# EAGLE design board (EAGLE 6.4)
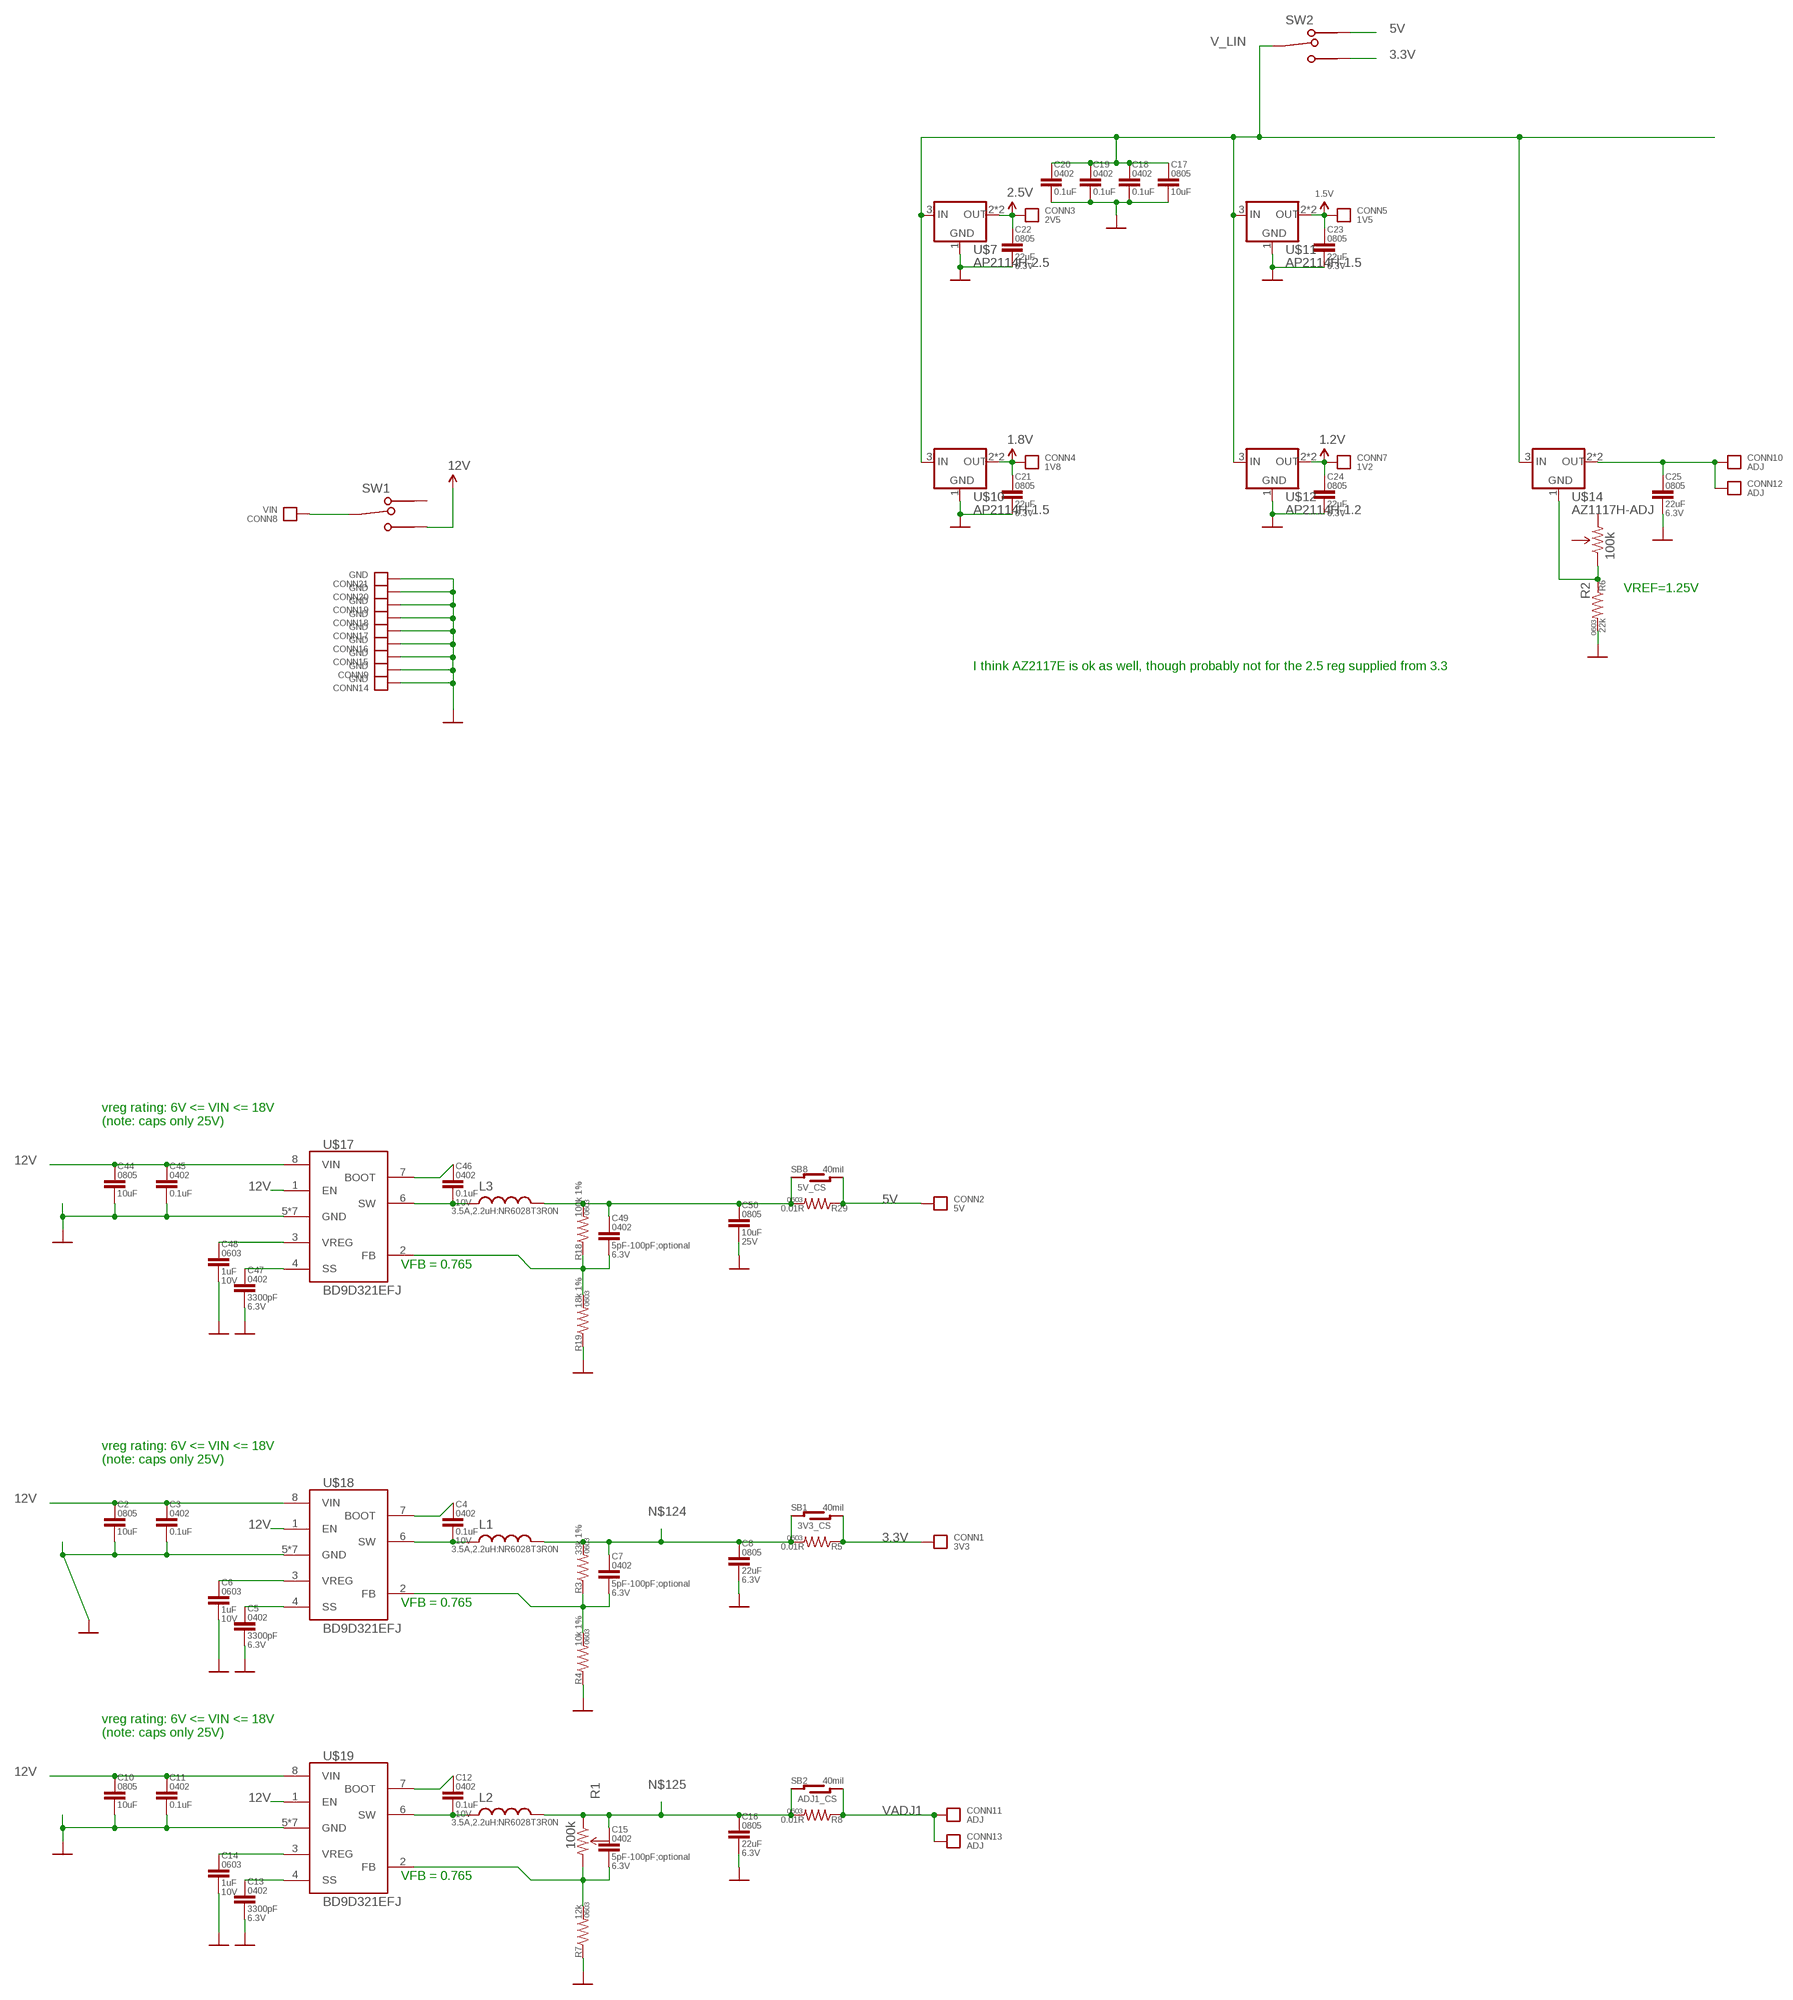
[diagram p0: schematic, sheet 1]

## Parts
C2  10uF  CAP0805  [0805-CAP]
C3  0.1uF  CAP0402-CAP  [0402-CAP]
C4  0.1uF  CAP0402-CAP  [0402-CAP]
C5  3300pF  CAP0402-CAP  [0402-CAP]
C6  1uF  CAP0603  [0603-CAP]
C7  5pF-100pF;optional  CAP0402-CAP  [0402-CAP]
C8  22uF  CAP0805  [0805-CAP]
C10  10uF  CAP0805  [0805-CAP]
C11  0.1uF  CAP0402-CAP  [0402-CAP]
C12  0.1uF  CAP0402-CAP  [0402-CAP]
C13  3300pF  CAP0402-CAP  [0402-CAP]
C14  1uF  CAP0603  [0603-CAP]
C15  5pF-100pF;optional  CAP0402-CAP  [0402-CAP]
C16  22uF  CAP0805  [0805-CAP]
C17  10uF  CAP0805  [0805-CAP]
C18  0.1uF  CAP0402-CAP  [0402-CAP]
C19  0.1uF  CAP0402-CAP  [0402-CAP]
C20  0.1uF  CAP0402-CAP  [0402-CAP]
C21  22uF  CAP0805  [0805-CAP]
C22  22uF  CAP0805  [0805-CAP]
C23  22uF  CAP0805  [0805-CAP]
C24  22uF  CAP0805  [0805-CAP]
C25  22uF  CAP0805  [0805-CAP]
C44  10uF  CAP0805  [0805-CAP]
C45  0.1uF  CAP0402-CAP  [0402-CAP]
C46  0.1uF  CAP0402-CAP  [0402-CAP]
C47  3300pF  CAP0402-CAP  [0402-CAP]
C48  1uF  CAP0603  [0603-CAP]
C49  5pF-100pF;optional  CAP0402-CAP  [0402-CAP]
C50  10uF  CAP0805  [0805-CAP]
CONN1  3V3  CONNECTOR22AWG  [HOLE_22AWG]
CONN2  5V  CONNECTOR22AWG  [HOLE_22AWG]
CONN3  2V5  CONNECTOR22AWG  [HOLE_22AWG]
CONN4  1V8  CONNECTOR22AWG  [HOLE_22AWG]
CONN5  1V5  CONNECTOR22AWG  [HOLE_22AWG]
CONN7  1V2  CONNECTOR22AWG  [HOLE_22AWG]
CONN8  VIN  CONNECTOR22AWG  [HOLE_22AWG]
CONN9  GND  CONNECTOR22AWG  [HOLE_22AWG]
CONN10  ADJ  CONNECTOR22AWG  [HOLE_22AWG]
CONN11  ADJ  CONNECTOR22AWG  [HOLE_22AWG]
CONN12  ADJ  CONNECTOR28AWG  [HOLE_28AWG]
CONN13  ADJ  CONNECTOR28AWG  [HOLE_28AWG]
CONN14  GND  CONNECTOR22AWG  [HOLE_22AWG]
CONN15  GND  CONNECTOR22AWG  [HOLE_22AWG]
CONN16  GND  CONNECTOR22AWG  [HOLE_22AWG]
CONN17  GND  CONNECTOR22AWG  [HOLE_22AWG]
CONN18  GND  CONNECTOR22AWG  [HOLE_22AWG]
CONN19  GND  CONNECTOR22AWG  [HOLE_22AWG]
CONN20  GND  CONNECTOR22AWG  [HOLE_22AWG]
CONN21  GND  CONNECTOR22AWG  [HOLE_22AWG]
L1  3.5A,2.2uH:NR6028T3R0N  INDUCTORNR60XX  [NR60XX]
L2  3.5A,2.2uH:NR6028T3R0N  INDUCTORNR60XX  [NR60XX]
L3  3.5A,2.2uH:NR6028T3R0N  INDUCTORNR60XX  [NR60XX]
R1  100k  TRIMPOTPTH  [TRIM_POT_PTH]
R2  100k  TRIMPOTPTH  [TRIM_POT_PTH]
R3  33k 1%  RESISTOR0603  [0603-RES]
R4  10k 1%  RESISTOR0603  [0603-RES]
R5  0.01R  RESISTOR0603  [0603-RES]
R6  22k  RESISTOR0603  [0603-RES]
R7  12k  RESISTOR0603  [0603-RES]
R8  0.01R  RESISTOR0603  [0603-RES]
R18  100k 1%  RESISTOR0603  [0603-RES]
R19  18k 1%  RESISTOR0603  [0603-RES]
R29  0.01R  RESISTOR0603  [0603-RES]
SB1  3V3_CS  SOLDER-BRIDGEOPEN-WIDE  [SOLDER-BRIDGE-OPEN-LARGE]
SB2  ADJ1_CS  SOLDER-BRIDGEOPEN-WIDE  [SOLDER-BRIDGE-OPEN-LARGE]
SB8  5V_CS  SOLDER-BRIDGEOPEN-WIDE  [SOLDER-BRIDGE-OPEN-LARGE]
SW1  SWITCH_SPDT  [SWITCH_SLIDE_SPDT]
SW2  SWITCH_SPDT  [SWITCH_SLIDE_SPDT]
U$7  AP2114H-2.5  VREGSOT223  [SOT223]
U$10  AP2114H-1.5  VREGSOT223  [SOT223]
U$11  AP2114H-1.5  VREGSOT223  [SOT223]
U$12  AP2114H-1.2  VREGSOT223  [SOT223]
U$14  AZ1117H-ADJ  VREGSOT223  [SOT223]
U$17  BD9D321EFJ  [HTSOP8]
U$18  BD9D321EFJ  [HTSOP8]
U$19  BD9D321EFJ  [HTSOP8]

## Nets
1.2V: C24.1 CONN7.P U$12.2(OUT) U$12.4(OUT)
1.5V: C23.1 CONN5.P U$11.2(OUT) U$11.4(OUT)
1.8V: C21.1 CONN4.P U$10.2(OUT) U$10.4(OUT)
2.5V: C22.1 CONN3.P U$7.2(OUT) U$7.4(OUT)
3.3V: CONN1.P R5.1 SB1.R1 SB1.R2 SW2.P2
3.3V_FB: C49.2 R18.1 R19.2 U$17.2(FB)
3.3V_FB1: C7.2 R3.1 R4.2 U$18.2(FB)
3.3V_FB2: C15.2 R1.3(CW) R7.2 U$19.2(FB)
5V: CONN2.P R29.1 SB8.R1 SB8.R2 SW2.P1
12V: C2.1 C3.1 C10.1 C11.1 C44.1 C45.1 SW1.P2 U$17.1(EN) U$17.8(VIN) U$18.1(EN) U$18.8(VIN) U$19.1(EN) U$19.8(VIN)
GND: C2.2 C3.2 C5.2 C6.2 C8.2 C10.2 C11.2 C13.2 C14.2 C16.2 C17.2 C18.2 C19.2 C20.2 C21.2 C22.2 C23.2 C24.2 C25.2 C44.2 C45.2 C47.2 C48.2 C50.2 CONN9.P CONN14.P CONN15.P CONN16.P CONN17.P CONN18.P CONN19.P CONN20.P CONN21.P R4.1 R6.2 R7.1 R19.1 U$7.1(GND) U$10.1(GND) U$11.1(GND) U$12.1(GND) U$17.5(GND) U$17.P$1(GND) U$17.P$2(GND) U$17.P$3(GND) U$17.P$4(GND) U$17.P$5(GND) U$17.PAD(GND) U$18.5(GND) U$18.P$1(GND) U$18.P$2(GND) U$18.P$3(GND) U$18.P$4(GND) U$18.P$5(GND) U$18.PAD(GND) U$19.5(GND) U$19.P$1(GND) U$19.P$2(GND) U$19.P$3(GND) U$19.P$4(GND) U$19.P$5(GND) U$19.PAD(GND)
N$2: C25.1 CONN10.P CONN12.P U$14.2(OUT) U$14.4(OUT)
N$4: C4.1 U$18.7(BOOT)
N$5: C4.2 L1.P$1 U$18.6(SW)
N$6: C6.1 U$18.3(VREG)
N$7: C5.1 U$18.4(SS)
N$8: C12.1 U$19.7(BOOT)
N$9: C12.2 L2.P$1 U$19.6(SW)
N$10: C14.1 U$19.3(VREG)
N$11: C13.1 U$19.4(SS)
N$12: R2.1(CCW) R6.1 U$14.1(GND)
N$70: C46.2 L3.P$1 U$17.6(SW)
N$71: C46.1 U$17.7(BOOT)
N$72: C48.1 U$17.3(VREG)
N$76: C47.1 U$17.4(SS)
N$123: C49.1 C50.1 L3.P$2 R18.2 R29.2 SB8.L1 SB8.L2
N$124: C7.1 C8.1 L1.P$2 R3.2 R5.2 SB1.L1 SB1.L2
N$125: C15.1 C16.1 L2.P$2 R1.1(CCW) R8.2 SB2.L1 SB2.L2
V_LIN: C17.1 C18.1 C19.1 C20.1 SW2.C U$7.3(IN) U$10.3(IN) U$11.3(IN) U$12.3(IN) U$14.3(IN)
VADJ1: CONN11.P CONN13.P R8.1 SB2.R1 SB2.R2
VIN_UNSW: CONN8.P SW1.C
Unconnected: R1.2(WIPER) R2.2(WIPER) R2.3(CW) SW1.P1

## Notes on the sheet
- VREF=1.25V
- I think AZ2117E is ok as well, though probably not for the 2.5 reg supplied from 3.3
- vreg rating: 6V <= VIN <= 18V
  (note: caps only 25V)
- VFB = 0.765
- vreg rating: 6V <= VIN <= 18V
  (note: caps only 25V)
- VFB = 0.765
- vreg rating: 6V <= VIN <= 18V
  (note: caps only 25V)
- VFB = 0.765

## Library data of the parts
C2 C10 C17 C44 C50 = kmod-passives:CAP: Capacitor Standard 0603 ceramic capacitor, and 0.1" leaded capacitor.; PACKAGE: 0805; VOLTAGE: 25V
C3 C11 C18-C20 C45 = kmod-passives:CAP: Capacitor Standard 0603 ceramic capacitor, and 0.1" leaded capacitor.; PACKAGE: 0402; VOLTAGE: 25V
C4 C12 C46 = kmod-passives:CAP: Capacitor Standard 0603 ceramic capacitor, and 0.1" leaded capacitor.; PACKAGE: 0402; VOLTAGE: 10V
C5 C7 C13 C15 C47 C49 = kmod-passives:CAP: Capacitor Standard 0603 ceramic capacitor, and 0.1" leaded capacitor.; PACKAGE: 0402; VOLTAGE: 6.3V
C6 C14 C48 = kmod-passives:CAP: Capacitor Standard 0603 ceramic capacitor, and 0.1" leaded capacitor.; PACKAGE: 0603; VOLTAGE: 10V
C8 C16 C21-C25 = kmod-passives:CAP: Capacitor Standard 0603 ceramic capacitor, and 0.1" leaded capacitor.; PACKAGE: 0805; VOLTAGE: 6.3V
CONN1-CONN5 CONN7-CONN21 = kmod-nonparts:CONNECTOR: Collection of holes/pads for testing/connecting
L1-L3 = kmod-passives:INDUCTOR
R1 R2 = SparkFun-Electromechanical:TRIMPOT: Various small potentiometers for "set-and-forget" applications
R3-R8 R18 R19 R29 = kmod-passives:RESISTOR: Resistor Basic schematic elements and footprints for 0603, 1206, and PTH resistors.; PACKAGE: 0603
SB1 SB2 SB8 = kmod-nonparts:SOLDER-BRIDGE; PACKAGE: 40mil
SW1 SW2 = kmod-mechanical:SWITCH_SPDT
U$7 U$10-U$12 U$14 = kmod-ics:VREG
U$17-U$19 = kmod-testing:BD9D321

## Board
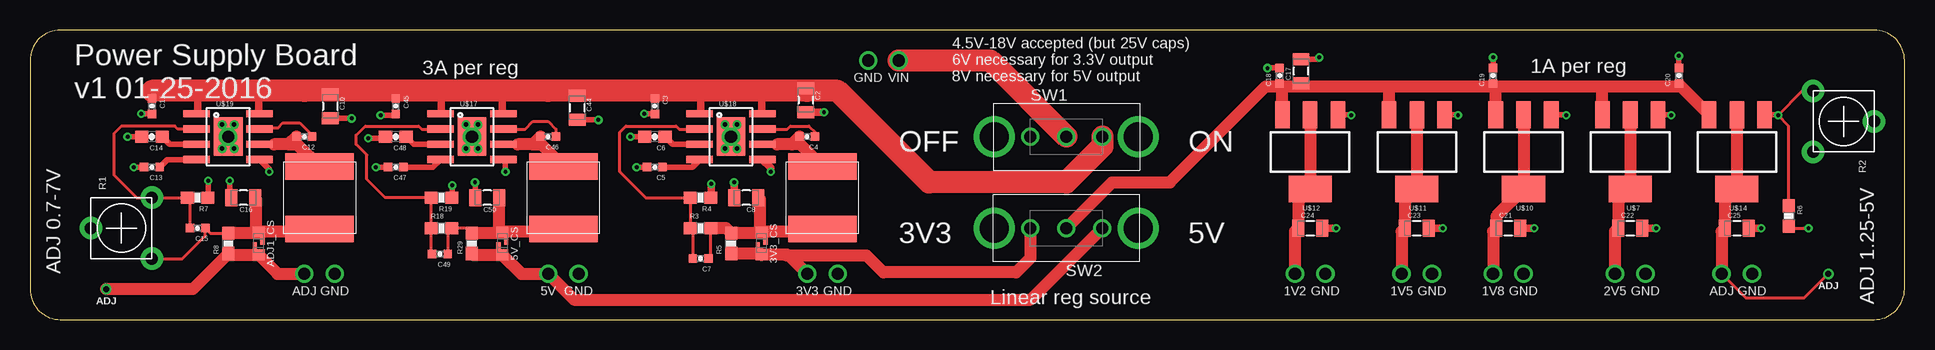
[diagram p1: board, top side]
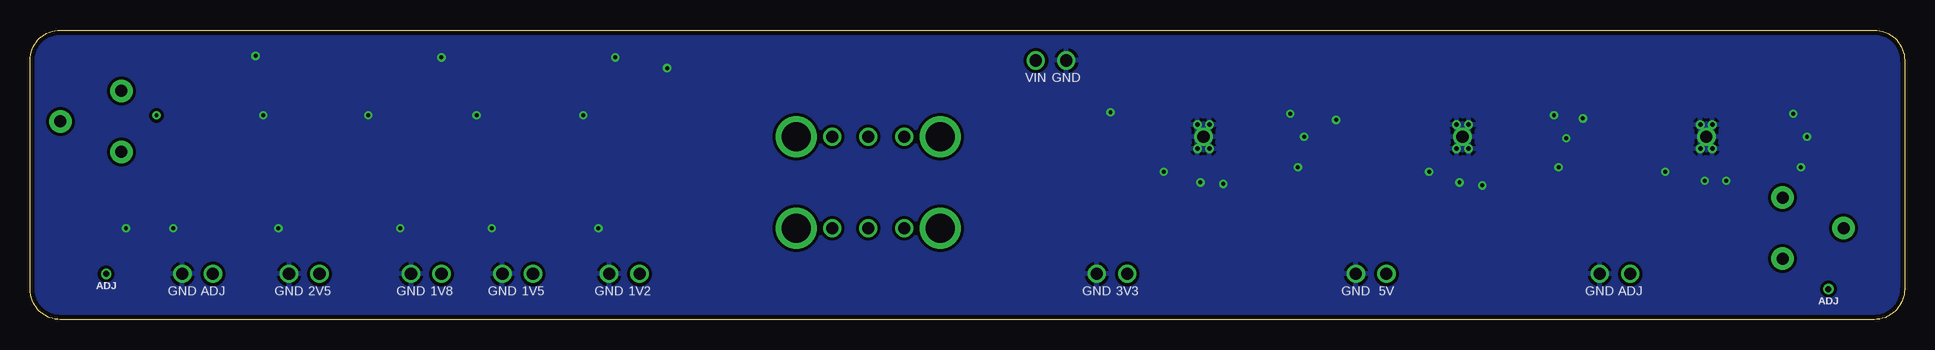
[diagram p2: board, bottom side, seen from below]

Size 156.21 x 24.13 mm. Coordinates in mm from the lower left corner, seen from the top.
Outline: 0,21.59 0,2.54 arc90 2.54,0 153.67,0 arc90 156.21,2.54 156.21,21.59 arc90 153.67,24.13 2.54,24.13 arc90 0,21.59
Copper layers (1*16): Top 0.0356mm / dielectric 1.5011mm / Bottom 0.0356mm
Design rules "OSHPark_mine": minimum track width 6mil, minimum drill 13mil, track to track 6mil, track to pad 6mil, pad to pad 6mil, via to via 6mil, smd to smd 6mil, copper to edge 15mil, drill to drill 6mil, minimum pad ring 7mil, minimum via ring 7mil, stop-mask expansion 2mil, vias tented up to drill 13mil, thermal gap 10mil

### Footprints (pad centres in the part's own frame; a part is rotated, then mirrored left to right if it is on the bottom)
0805-CAP = smd 1 x 1.4: 1 -1,0; 2 1,0
0402-CAP = smd 0.7 x 0.7: 1 -0.65,0; 2 0.65,0
0603-CAP = smd 1.1 x 1: 1 -0.85,0; 2 0.85,0
HOLE_22AWG = drill 1.016: P 0,0
HOLE_28AWG = drill 0.508: P 0,0
NR60XX = smd 2.2 x 5.7: P$1 2.6,0; P$2 -2.6,0
TRIM_POT_PTH = drill 1 pad 1.88: 1 -2.54,-2.54; 2 0,2.54; 3 2.54,-2.54
0603-RES = smd 1.1 x 1: 1 -0.85,0; 2 0.85,0
SOLDER-BRIDGE-OPEN-LARGE = smd 0.9 x 1: L1 -0.95,0; R1 0.95,0 | smd 0.6 x 0.35: L2 -0.2,0.325; R2 0.2,-0.325
SWITCH_SLIDE_SPDT = drill 1: C 0,0; P1 -3,0; P2 3,0 | drill 2.4: MNT1 -6,0; MNT2 6,0
SOT223 = smd 1.219 x 2.235: 1 -2.311,-3.099; 2 0,-3.099; 3 2.311,-3.099 | smd 3.6 x 2.2: 4 0,3.099
HTSOP8 = smd 0.61 x 2.21: 1 -1.905,-2.616; 2 -0.635,-2.616; 3 0.635,-2.616; 4 1.905,-2.616; 5 1.905,2.616; 6 0.635,2.616; 7 -0.635,2.616; 8 -1.905,2.616 | drill 1.016: P$1 0,0 | drill 0.381: P$2 -1,0.5; P$3 -1,-0.5; P$4 1,-0.5; P$5 1,0.5 | smd 3.2 x 2.4: PAD 0,0

### Placement (x,y rotation side)
C2  64.64,18.29 270 top
C3  52.07,17.78 270 top
C4  64.77,15.24 180 top
C5  52.07,12.7 180 top
C6  52.07,15.24 180 top
C7  55.88,5.08 180 top
C8  59.69,10.16 180 top
C10  25.02,17.78 270 top
C11  10.16,17.78 270 top
C12  22.86,15.24 180 top
C13  10.16,12.7 180 top
C14  10.16,15.24 180 top
C15  13.97,7.62 180 top
C16  17.78,10.16 180 top
C17  105.92,20.7 90 top
C18  104.14,20.32 90 top
C19  121.92,20.32 90 top
C20  137.41,20.32 90 top
C21  123.19,7.62 0 top
C22  133.35,7.62 0 top
C23  115.57,7.62 0 top
C24  106.68,7.62 0 top
C25  142.24,7.62 0 top
C44  45.59,17.65 270 top
C45  30.48,17.78 270 top
C46  43.18,15.24 180 top
C47  30.48,12.7 180 top
C48  30.48,15.24 180 top
C49  34.16,5.46 180 top
C50  38.1,10.16 180 top
CONN1  64.77,3.81 0 top
CONN2  43.18,3.81 0 top
CONN3  132.08,3.81 0 top
CONN4  121.92,3.81 0 top
CONN5  114.3,3.81 0 top
CONN7  105.41,3.81 0 top
CONN8  72.39,21.59 0 top
CONN9  69.85,21.59 0 top
CONN10  140.97,3.81 0 top
CONN11  22.86,3.81 0 top
CONN12  149.86,3.81 0 top
CONN13  6.35,2.54 0 top
CONN14  45.72,3.81 0 top
CONN15  67.31,3.81 0 top
CONN16  25.4,3.81 0 top
CONN17  107.95,3.81 0 top
CONN18  116.84,3.81 0 top
CONN19  124.46,3.81 0 top
CONN20  134.62,3.81 0 top
CONN21  143.51,3.81 0 top
L1  66.04,10.16 90 top
L2  24.13,10.16 90 top
L3  44.45,10.16 90 top
R1  7.62,7.62 90 top
R2  151.13,16.51 270 top
R3  55.88,7.62 0 top
R4  55.88,10.16 180 top
R5  58.42,6.35 90 top
R6  146.56,8.64 270 top
R7  13.97,10.16 180 top
R8  16.51,6.35 90 top
R18  34.29,7.62 0 top
R19  34.29,10.16 180 top
R29  36.83,6.35 90 top
SB1  60.96,6.35 270 top
SB2  19.05,6.35 270 top
SB8  39.37,6.35 270 top
SW1  86.36,15.24 0 top
SW2  86.36,7.62 180 top
U$7  133.35,13.97 180 top
U$10  124.46,13.97 180 top
U$11  115.57,13.97 180 top
U$12  106.68,13.97 180 top
U$14  142.24,13.97 180 top
U$17  36.83,15.24 270 top
U$18  58.42,15.24 270 top
U$19  16.51,15.24 270 top

### Tracks (layer width: path | path; a pad name or v marks a point on that pad's centre or on a via)
1.2V
  Top 1.016: U$12.2 U$12.4 105.68,9.87 C24.1 105.41,7.35 CONN7.P
1.5V
  Top 1.016: U$11.2 U$11.4 114.57,9.87 C23.1 114.3,7.35 CONN5.P
1.8V
  Top 1.016: U$10.2 U$10.4 122.19,8.6 C21.1 121.92,7.35 CONN4.P
2.5V
  Top 1.016: U$7.2 U$7.4 132.35,9.87 C22.1 132.08,7.35 CONN3.P
3.3V
  Top 0.254: 60.86,5.5 60.63,5.72 SB1.R2
  Top 1.016: CONN1.P 63.18,5.4 62.99,5.4 | 62.99,5.4 SB1.R1 60.86,5.5 R5.1 | SW2.P2 83.36,5.13 82.17,3.94 71.12,3.94 69.72,5.33 63.06,5.33 62.99,5.4
3.3V_FB
  Top 0.254: U$17.2 32.64,15.88 32.38,16.13 27.94,16.13 27.18,15.37 27.18,14.61 28.07,13.72 28.07,11.68 29.59,10.16 R19.2 R18.1 33.44,5.53 C49.2
3.3V_FB1
  Top 0.254: U$18.2 54.1,15.88 53.85,16.13 49.66,16.13 49.15,15.62 49.15,12.32 51.31,10.16 R4.2 R3.1 55.23,7.42 C7.2
3.3V_FB2
  Top 0.254: U$19.2 12.32,15.88 12.06,16.13 7.62,16.13 6.99,15.49 6.99,12.06 8.89,10.16 R1.3 R7.2 13.32,9.96 C15.2
5V
  Top 0.254: SB8.R1 39.05,5.72 SB8.R2
  Top 1.016: R29.1 36.93,5.4 SB8.R1 40.96,3.81 CONN2.P 45.34,1.65 83.39,1.65 SW2.P1
12V
  Top 0.61: U$18.1 55.88,17.22 55.88,19.05 | U$18.8 60.96,17.22 60.96,19.05 | U$17.8 39.37,17.22 39.37,19.05 | U$17.1 34.29,17.22 34.29,19.05 | U$19.8 19.05,17.22 19.05,19.05 | U$19.1 13.97,17.22 13.97,19.05 | C11.1 10.16,19.05 | C45.1 30.48,19.05 | C10.1 22.86,19.05 | C44.1 43.18,19.05 | C3.1 52.07,19.05 | C2.1 64.77,19.05
  Top 1.829: SW1.P2 89.36,14.43 86.36,11.43 74.93,11.43 67.31,19.05 64.77,19.05 60.96,19.05 55.88,19.05 52.07,19.05 43.18,19.05 39.37,19.05 34.29,19.05 30.48,19.05 22.86,19.05 19.05,19.05 13.97,19.05 10.16,19.05
GND  (via drill 0.33)
  Top 0.254: R6.2 146.72,7.62 v148.21,7.62
  Top 0.457: C11.2 10.14,17.14 v9.27,17.14 | C14.2 v8.13,15.24 | C13.2 v8.64,12.7 | U$19.5 19.94,12.52 v19.94,12.32 | C16.2 16.64,10.3 v16.64,11.56 | R7.1 14.86,10.2 v14.86,11.56 | C10.2 25.04,16.76 v26.8,16.76 | C48.2 29.5,15.11 v28.19,15.11 | C45.2 30.37,17.02 v29.21,17.02 | C47.2 v28.83,12.7 | U$17.5 39.62,13.16 v39.62,12.32 | C44.2 45.61,16.64 v47.37,16.64 | C3.2 52.05,17.14 v51.18,17.14 | C6.2 v50.04,15.24 | C5.2 v50.55,12.7 | R19.1 35.18,10.2 v35.18,11.18 | C50.2 37.08,10.18 v37.08,11.43 | C18.2 103.39,20.97 v103.12,20.95 | C17.2 107.3,21.7 v107.44,21.84 | U$12.1 110.06,17.07 v110.11,17.02 | U$11.1 118.95,17.07 v119,17.02 | U$10.1 127.97,17.07 v128.02,17.02 | U$7.1 136.73,17.07 v136.78,17.02 | C19.2 v121.92,21.84 | C20.2 v137.41,21.97
  Top 0.61: C2.2 64.66,17.27 v66.17,17.27 | C8.2 58.67,10.18 v58.67,11.43 | R4.1 56.77,10.2 v56.77,11.3 | U$18.5 61.72,12.65 v61.72,12.32 | C24.2 v108.84,7.62 | C23.2 v117.73,7.62 | C21.2 v125.35,7.62 | C22.2 v135.51,7.62 | C25.2 v144.27,7.62
  pour Bottom (isolate 0.254): -4,33.84 158.76,33.84 158.76,-4 -4,-4
N$2
  Top 0.254: CONN12.P 147.83,1.78 143,1.78 CONN10.P
  Top 1.016: U$14.2 U$14.4 141.24,9.87 C25.1 140.97,7.35 CONN10.P
N$4
  Top 0.254: U$18.7 63.12,15.88 63.37,16.13 64.9,16.13 65.42,15.61 C4.1
N$5
  Top 0.61: 62.23,14.61 U$18.6
  Top 1.016: L1.P$1 64.19,14.61 63.48,14.61 | C4.2 63.48,14.61 | 63.48,14.61 62.23,14.61
N$6
  Top 0.457: U$18.3 53.55,14.61 C6.1
N$7
  Top 0.457: U$18.4 55.17,12.7 C5.1
N$8
  Top 0.254: U$19.7 19.25,16 20.7,16 21.08,16.38 22.48,16.38 23.51,15.35 C12.1
N$9
  Top 0.61: U$19.6 20.32,14.61
  Top 1.016: 21.57,14.61 22.29,14.61 L2.P$1 | C12.2 21.57,14.61 | 21.57,14.61 20.32,14.61
N$10
  Top 0.457: C14.1 11.64,14.61 U$19.3
N$11
  Top 0.457: C13.1 11.45,13.34 U$19.4
N$12  (via drill 0.33)
  Top 0.254: R6.1 146.56,16.13 v145.67,17.02 147.7,19.05 R2.1
  Top 0.457: U$14.1 145.62,17.07 v145.67,17.02
N$70
  Top 0.61: U$17.6 40.64,14.61
  Top 1.016: 41.9,14.61 42.6,14.61 L3.P$1 | C46.2 41.9,14.61 | 41.9,14.61 40.64,14.61
N$71
  Top 0.254: U$17.7 41.27,15.88 41.91,16.51 43.18,16.51 43.83,15.86 C46.1
N$72
  Top 0.457: C48.1 31.96,14.61 U$17.3
N$76
  Top 0.457: U$17.4 33.58,12.7 C47.1
N$123
  Top 0.254: R29.2 36.41,7.62 R18.2 34.81,7.29 C49.1 | 39.27,7.2 39.7,6.78 SB8.L2
  Top 1.016: L3.P$2 44.19,7.3 SB8.L1 | SB8.L1 39.27,7.2 R29.2 | SB8.L1 39.1,7.57 C50.1
N$124
  Top 0.254: C7.1 56.73,5.28 R3.2 | 60.86,7.2 61.28,6.78 SB1.L2
  Top 1.016: L1.P$2 65.78,7.3 SB1.L1 | SB1.L1 60.86,7.2 R5.2 58,7.62 R3.2 | C8.1 60.83,10.02 60.83,7.24 60.89,7.3 SB1.L1
N$125
  Top 0.254: R1.1 12.7,5.08 14.62,7 C15.1 15.04,7.2 R8.2 | 18.95,7.2 19.38,6.78 SB2.L2
  Top 1.016: L2.P$2 23.87,7.3 SB2.L1 18.95,7.2 18.8,7.2 | 18.8,7.2 R8.2 | C16.1 18.8,10.14 18.8,7.2
V_LIN
  Top 0.254: C20.1 137.41,19.43 | C18.1 104.14,19.56 104.27,19.43
  Top 0.457: C17.1 105.92,19.56 106.05,19.43 | 122.15,19.41 122.15,19.53 122.17,19.56 122.03,19.56 C19.1
  Top 1.016: SW2.C 90.17,11.43 95,11.43 103,19.43 104.27,19.43 104.39,19.43 | 104.39,19.43 106.05,19.43 113.41,19.43 | 113.41,19.43 122.17,19.43 | 122.17,19.43 131.19,19.43 | 131.19,19.43 137.41,19.43 137.57,19.43 U$14.3 | U$12.3 104.37,19.41 104.39,19.43 | U$10.3 122.15,19.41 122.17,19.43 | U$7.3 131.04,19.28 131.19,19.43 | U$11.3 113.26,19.28 113.41,19.43
VADJ1
  Top 0.254: SB2.R1 18.73,5.72 SB2.R2
  Top 1.016: CONN11.P 20.64,3.81 SB2.R1 16.61,5.4 R8.1 13.55,2.54 CONN13.P
VIN_UNSW
  Top 1.829: CONN8.P 80.01,21.59 SW1.C

### Text on the board
tPlace: 1A per reg | 3A per reg | 4.5V-18V accepted (but 25V caps) / 6V necessary for 3.3V output / 8V necessary for 5V output | Power Supply Board / v1 01-25-2016 | OFF | ON | 3V3 | 5V | ADJ 0.7-7V | Linear reg source | ADJ 1.25-5V